# EAGLE design BLE-Board-v2 (EAGLE 7.7.0)
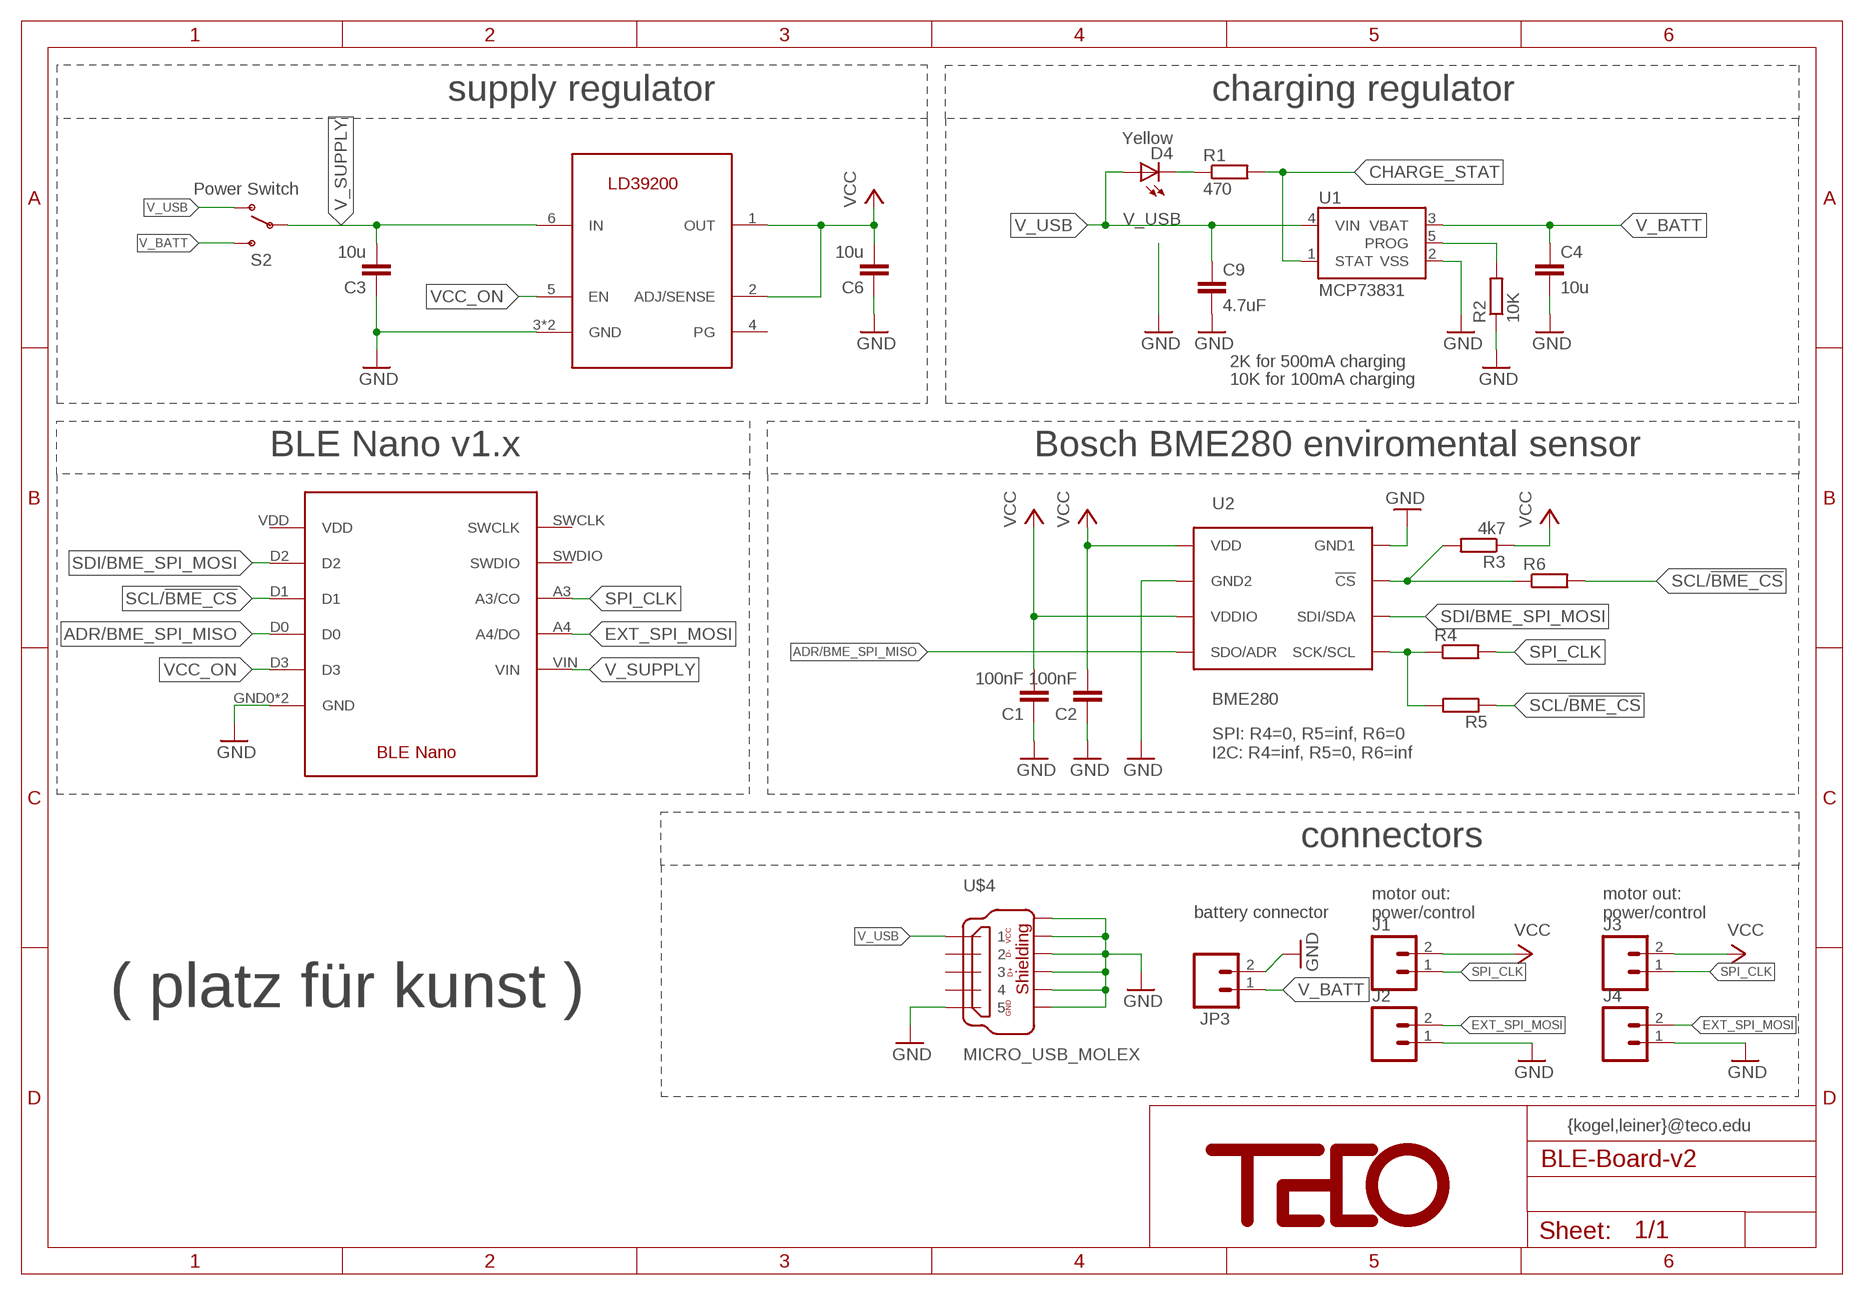
[diagram p0: schematic, sheet 1]

## Parts
C1  100nF  C-EUC0603K  [C0603K]
C2  100nF  C-EUC0603K  [C0603K]
C3  10u  C-EUC0603K  [C0603K]
C4  10u  C-EUC0603K  [C0603K]
C6  10u  C-EUC0603K  [C0603K]
C9  4.7uF  C-EUC0603K  [C0603K]
D4  Yellow  LED0603  [LED-0603]
J1  M02PTH  [1X02]
J2  M02PTH  [1X02]
J3  M02PTH  [1X02]
J4  M02PTH  [1X02]
JP3  M02-JST-2MM-SMT  [JST-2-SMD]
R1  470  R-EU_R0402  [R0402]
R2  10K  R-EU_R0402  [R0402]
R3  4k7  R-EU_R0402  [R0402]
R4  R-EU_R0201  [R0201]
R5  R-EU_R0201  [R0201]
R6  R-EU_R0201  [R0201]
S2  Power Switch  SWITCH-SPSTSMD  [AYZ0202]
U1  MCP73831  [SOT23-5]
U2  BME280  [BME280_LGA]
U$1  BLE-NANO  [BLE-NANO]
U$2  LD39200DNF6  [DFN6-3X3]
U$3  TECO-LOGO-BIG  [TECO-LOGO-BIG]
U$4  MICRO_USB_MOLEX  [MICRO_USB_MOLEX]

## Nets
ADR/BME_SPI_MISO: U2.P$5(SDO/ADR) U$1.D0
CHARGE_STAT: R1.2 U1.1(STAT)
EXT_SPI_MOSI: J2.2 J4.2 U$1.A4(A4/DO)
GND: C1.1 C2.1 C3.1 C4.2 C6.1 C9.2 J2.1 J4.1 JP3.2 R2.1 U1.2(VSS) U2.P$1(GND1) U2.P$7(GND2) U$1.GND0(GND) U$1.GND1(GND) U$2.3(GND) U$2.EXP(GND) U$4.5 U$4.SHIELD@1 U$4.SHIELD@2 U$4.SHIELD@3 U$4.SHIELD@4 U$4.SHIELD@5 U$4.SHIELD@6
N$1: D4.C R1.1
N$3: R4.1 R5.2 U2.P$4(SCK/SCL)
N$4: R3.2 R6.1 U2.P$2(!CS)
N$11: R2.2 U1.5(PROG)
SCL/!BME_CS: R5.1 R6.2 U$1.D1
SDI/BME_SPI_MOSI: U2.P$3(SDI/SDA) U$1.D2
SPI_CLK: J1.1 J3.1 R4.2 U$1.A3(A3/CO)
V_BATT: C4.1 JP3.1 S2.3(S) U1.3(VBAT)
V_SUPPLY: C3.2 S2.2(P) U$1.VIN U$2.6(IN)
V_USB: C9.1 D4.A S2.1(O) U1.4(VIN) U$4.1
VCC: C1.2 C2.2 C6.2 J1.2 J3.2 R3.1 U2.P$6(VDDIO) U2.P$8(VDD) U$2.1(OUT) U$2.2(ADJ/SENSE)
VCC_ON: U$1.D3 U$2.5(EN)
Unconnected: U$1.SWCLK U$1.SWDIO U$1.VDD U$2.4(PG) U$4.2 U$4.3 U$4.4

## Notes on the sheet
- supply regulator | charging regulator
- 2K for 500mA charging
- 10K for 100mA charging
- BLE Nano v1.x | Bosch BME280 enviromental sensor
- SPI: R4=0, R5=inf, R6=0
  I2C: R4=inf, R5=0, R6=inf
- connectors
- battery connector
- motor out:
  power/control
- motor out:
  power/control
- ( platz für kunst )
- {kogel,leiner}@teco.edu

## Library data of the parts
C1-C4 C6 C9 = rcl:C-EU: CAPACITOR, European symbol
D4 = SparkFun:LED: LEDs Standard schematic elements and footprints for 5mm, 3mm, 1206, and 0603 sized LEDs. 5mm - Spark Fun Electronics SKU : COM-00529 (and others)
J1-J4 = SparkFun-Connectors:M02: Standard 2-pin 0.1" header. Use with - straight break away headers ( PRT-00116) - right angle break away headers (PRT-00553) - swiss pins (PRT-00743) - machine pins (PRT-00117) - female headers (PRT-00115) Molex polarized connector foot print use with: PRT-08233 with associated crimp pins and housings. 2.54_SCREWTERM for use with PRT-10571. 3.5mm Screw Terminal footprints for PRT-08084 5mm Screw Terminal footprints for use with PRT-08432
JP3 = SparkFun:M02: Header 2 Standard 2-pin 0.1" header. Use with straight break away headers (SKU : PRT-00116), right angle break away headers (PRT-00553), swiss pins (PRT-00743), machine pins (PRT-00117), and female headers (PRT-00115). Molex polarized connector foot print use with SKU : PRT-08233 with associated crimp pins and housings.
R1-R6 = rcl:R-EU_: RESISTOR, European symbol
S2 = SparkFun:SWITCH-SPST: SPST Switch Simple slide switch. Spark Fun Electronics SKU : COM-00102
U1 = SparkFun:MCP73831: Microchip's MCP73831 Miniature single cell, fully integrated Li-Ion, Li-polymer charge management controller http://ww1.microchip.com/downloads/en/DeviceDoc/21984a.pdf
U2 = BME280ComponentLibrary:BME280; PROD_ID: IC-13090
U$1 = BLE-Nano:BLE-NANO
U$2 = BLE-Nano:LD39200
U$3 = teco_div:TECO-LOGO-BIG
U$4 = teco_conn:MICRO_USB_MOLEX

## Board
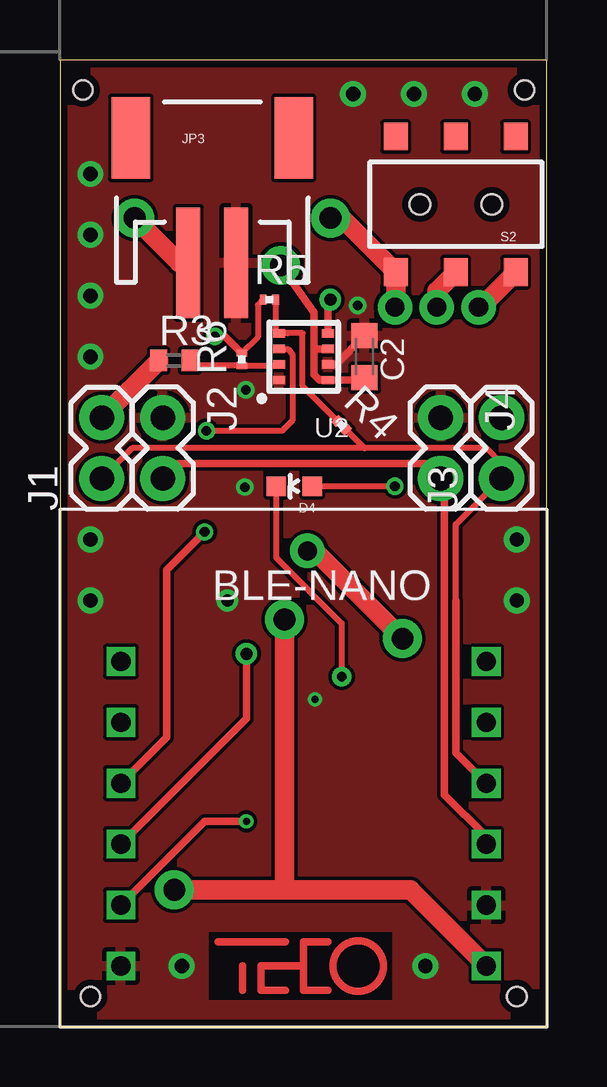
[diagram p1: board, top side]
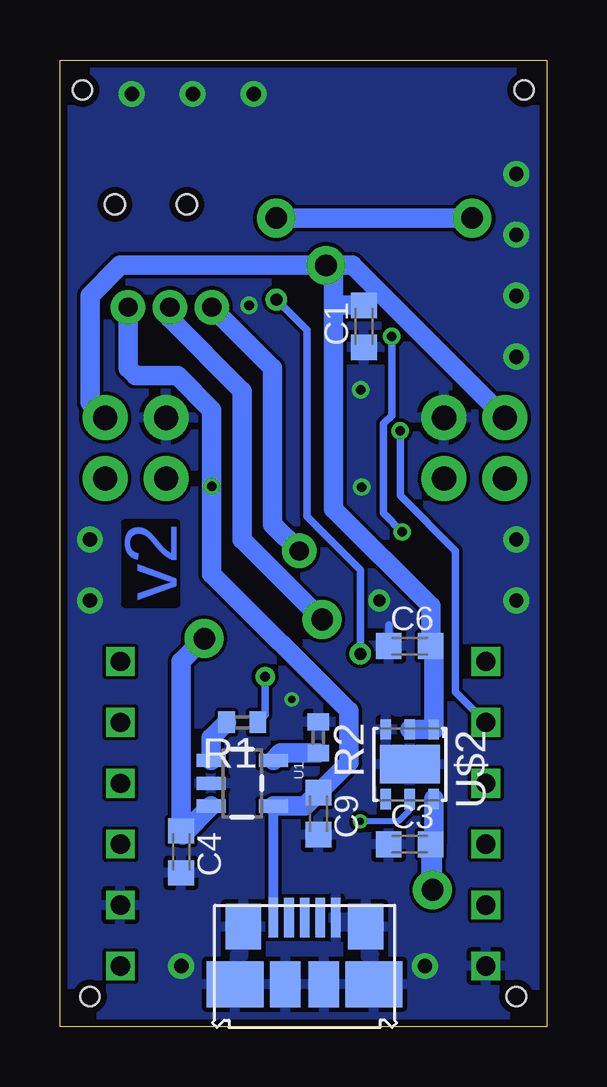
[diagram p2: board, bottom side, seen from below]

Size 20.3 x 40.31 mm. Coordinates in mm from the lower left corner, seen from the top.
Outline: 0,0 20.3,0 20.3,40.31 0,40.31 0,0
Copper layers (1*16): Top 0.035mm / dielectric 1.5mm / Bottom 0.035mm
Design rules "PCB-POOL Standard": minimum track width 0.15mm, minimum drill 0.3mm, track to track 0.15mm, track to pad 0.15mm, pad to pad 0.15mm, via to via 0.15mm, smd to smd 0.15mm, copper to edge 0.3mm, drill to drill 0.2mm, minimum pad ring 0.2mm, minimum via ring 0.15mm, stop-mask expansion 0.075mm, vias tented up to drill 0mil, thermal gap 0.2mm
Holes 0.8 mm at 1.27,1.27 19.05,1.27 19.37,39.05 0.95,39.05

### Footprints (pad centres in the part's own frame; a part is rotated, then mirrored left to right if it is on the bottom)
C0603K = smd 1.05 x 1.08: 1 -0.875,0; 2 0.875,0
LED-0603 = smd 0.8 x 0.8: A 0,-0.75; C 0,0.75
1X02 = drill 1.016 pad 1.88: 1 0,0; 2 2.54,0
JST-2-SMD = smd 1 x 4.6: 1 -1,-3.7; 2 1,-3.7 | smd 1.6 x 3.4: NC1 -3.4,1.5; NC2 3.4,1.5
R0402 = smd 0.7 x 0.9: 1 -0.65,0; 2 0.65,0
R0201 = smd 0.28 x 0.43: 1 -0.255,0; 2 0.255,0
AYZ0202 = smd 1 x 1.15: 1 -2.5,2.825; 2 0,2.825; 3 2.5,2.825; 4 -2.5,-2.825; 5 0,-2.825; 6 2.5,-2.825 | hole 0.85: 1.5,0; -1.5,0
SOT23-5 = smd 0.55 x 1.2: 1 -0.95,-1.3; 2 0,-1.3; 3 0.95,-1.3; 4 0.95,1.3; 5 -0.95,1.3
BME280_LGA = smd 0.5 x 0.35: P$1 1.025,0.975; P$2 1.025,0.325; P$3 1.025,-0.325; P$4 1.025,-0.975; P$5 -1.025,-0.975; P$6 -1.025,-0.325; P$7 -1.025,0.325; P$8 -1.025,0.975
BLE-NANO = drill 0.8 square: A3 15.24,7.62; A4 15.24,5.08; D0 0,5.08; D1 0,7.62; D2 0,10.16; D3 0,2.54; GND0 0,0; GND1 15.24,2.54; SWCLK 15.24,12.7; SWDIO 15.24,10.16; VDD 0,12.7; VIN 15.24,0
DFN6-3X3 = smd 0.85 x 0.45: 1 -1.45,1; 2 -1.45,0; 3 -1.45,-1; 4 1.45,-1; 5 1.45,0; 6 1.45,1 | smd 1.6 x 2.5: EXP 0,0
MICRO_USB_MOLEX = smd 0.4 x 1.634: 1 5.05,0.523; 2 4.4,0.523; 3 3.75,0.523; 4 3.1,0.523; 5 2.45,0.523 | smd 1.475 x 1.9: SHIELD@1 6.3,0.9; SHIELD@6 1.2,0.9 | smd 2.375 x 1.9: SHIELD@2 6.65,3.3; SHIELD@5 0.85,3.3 | smd 1.27 x 1.9: SHIELD@3 4.55,3.3; SHIELD@4 2.95,3.3

### Placement (x,y rotation side)
C1  7.62,29.21 90 bottom
C2  12.7,27.94 270 top
C3  5.71,7.62 0 bottom
C4  15.24,7.3 270 bottom
C6  5.71,15.88 0 bottom
C9  9.53,8.89 270 bottom
D4  9.77,22.54 90 top
J1  1.75,22.86 90 top
J2  4.29,25.4 270 top
J3  18.41,22.86 90 top
J4  15.88,25.4 270 top
JP3  6.35,35.56 0 top
R1  12.7,12.7 180 bottom
R2  9.53,12.06 270 bottom
R3  4.76,27.78 0 top
R4  11.75,25.08 315 top
R5  8.73,30.32 0 top
R6  7.58,27.83 90 top
S2  16.51,34.29 180 top
U1  12.7,10.16 270 bottom
U2  10.16,27.94 180 top
U$1  2.54,2.54 0 top
U$2  5.71,10.95 270 bottom
U$3  10.16,2.54 0 top
U$4  6.35,5.08 180 bottom

### Tracks (layer width: path | path; a pad name or v marks a point on that pad's centre or on a via)
ADR/BME_SPI_MISO  (via drill 0.5)
  Top 0.305: v7.78,15.56 7.78,12.86 U$1.D0 | v11.27,30.32 11.19,30.23 U2.P$5
  Bottom 0.305: v7.78,15.56 7.78,19.05 10,21.27 10,29.05 v11.27,30.32
CHARGE_STAT
  Bottom 0.813: R1.2 14,12.05 U1.1
EXT_SPI_MOSI
  Top 0.305: U$1.A4 17.78,7.94 16.03,9.68 16.03,22.7 J4.2 15.24,23.5 4.92,23.5 J2.2
GND  (via drill 0.3, 0.4, 0.5 pad 0.81, 0.6)
  Top 0.305: C2.1 11.5,27.61 U2.P$7
  Bottom 0.305: C6.1 6.59,16.75
  other vias: 6.99,17.78 10.64,13.65 1.27,30.48 1.27,27.94 1.27,33.02 1.27,35.56 12.22,38.89 14.76,38.89 17.3,38.89 1.27,20.32 1.27,17.78 19.05,20.32 19.05,17.78 15.24,2.54 5.08,2.54 7.75,26.55 12.41,30.08 7.71,22.5
  pour Bottom: 0,0 0,40.64 20.32,40.64 20.32,0
  pour Top: 0,40.64 20.32,40.64 20.32,0 0,0
N$1  (via drill 0.4 pad 0.81)
  Top 0.254: v11.75,14.61 11.75,16.83 9.02,19.55 D4.C
  Bottom 0.305: v11.75,14.61 11.75,13 R1.1
N$3
  Top 0.254: 9.5,28.91 U2.P$4 | R5.2 8.99,29.06 U2.P$4 | U2.P$4 10.12,28.91 10.12,26.71 R4.1
N$4
  Top 0.254: U2.P$2 9.1,27.57 R6.1 5.62,27.57 R3.2
N$11
  Bottom 0.813: R2.2 11.1,11.41 U1.5
SCL/!BME_CS  (via drill 0.4)
  Top 0.254: R5.1 8.26,30.1 8.26,28.76 R6.2
  Top 0.305: U$1.D1 4.45,12.06 4.45,19.05 v6.03,20.64 | v6.46,28.79 6.88,28.79 R6.2
  Bottom 0.305: v6.03,20.64 6.82,21.42 6.82,25.14 6.46,25.5 v6.46,28.79
SDI/BME_SPI_MOSI  (via drill 0.4)
  Top 0.254: U2.P$3 9.14,28.26 9.53,28.26 9.69,28.03 9.69,25.29 9.26,24.85 v6.11,24.85
  Bottom 0.305: U$1.D2 3.81,13.97 3.81,19.84 6.11,22.14 v6.11,24.85
SPI_CLK
  Top 0.254: 12.7,24.13 17.78,24.13 18.41,23.5 J3.1 16.51,20.95 16.51,17.78 | 12.7,24.13 3.02,24.13 J1.1 | R4.2 | R4.2 12.7,24.13
  Top 0.305: U$1.A3 16.51,11.43 16.51,17.78
V_BATT  (via drill 0.8, 0.8 pad 0.81, 0.9, 0.9 pad 0.81)
  Top 0.813: 14.01,29.89 v13.97,30 14.01,30.04 S2.3 11.75,33.72 v11.28,33.72 | v14.29,16.19 10.64,19.84 v10.32,19.84 | JP3.1 4.98,31.86 v3.11,33.72
  Bottom 0.813: U1.3 15.2,8.02 C4.1 15.24,15.24 v14.29,16.19 | v13.97,30 11.43,27.46 11.43,20.95 v10.32,19.84 | v3.11,33.72 v11.28,33.72
V_SUPPLY  (via drill 0.8, 0.9, 0.9 pad 0.81)
  Top 0.813: U$1.VIN 14.61,5.71 9.37,5.71 | 9.37,5.71 v4.76,5.71 | v9.37,16.99 9.37,5.71 | v15.72,30 15.72,30.67 S2.2
  Bottom 0.406: 4.74,7.62 C3.2 4.71,7.62
  Bottom 0.813: C3.2 4.76,7.62 v4.76,5.71 4.84,5.79 C3.2 | v9.37,16.99 12.7,20.32 12.7,26.51 15.72,29.53 v15.72,30 | U$2.6 4.71,7.75 C3.2
V_USB  (via drill 0.4, 0.8)
  Top 0.254: D4.A v13.97,22.54
  Top 0.813: v17.46,30 17.55,30 S2.1
  Bottom 0.406: U$4.1 | U$4.1 U1.4
  Bottom 0.813: U1.4 10.08,9.21 C9.1 8.26,11.04 8.26,13.18 13.97,18.89 v13.97,22.54 13.97,25.72 15.4,27.15 17.14,27.15 17.46,27.46 v17.46,30
VCC  (via drill 0.9)
  Top 0.254: 10.8,28.27 10.77,28.27 10.6,28.43
  Top 0.305: U2.P$8 11.16,26.99 10.79,26.99 | U2.P$6 10.8,28.27 | U2.P$8 10.82,26.96 10.6,27.19 10.6,28.43 10.6,29.77 v9.21,31.75 | C2.2 12.6,26.96 U2.P$8
  Top 0.813: R3.1 4.11,27.77 J1.2
  Bottom 0.813: v9.21,31.75 17.78,31.75 19.05,30.48 19.05,26.04 J3.2 | 8.89,30 8.89,21.59 4.84,17.54 C6.2 4.71,15.88 U$2.1 U$2.2 | 8.89,30 8.89,31.43 v9.21,31.75 | C1.2 8.81,30.09 8.89,30 | v9.21,31.75 8.1,31.75 J1.2
VCC_ON  (via drill 0.3)
  Top 0.305: U$1.D3 6.03,8.57 v7.78,8.57
  Bottom 0.254: v7.78,8.57 6.19,8.57 5.71,9.05 U$2.5

### Text on the board
Bottom: v2